# Altium schematic sheet AEBS component_FrontV1.2.SchDoc
size A4
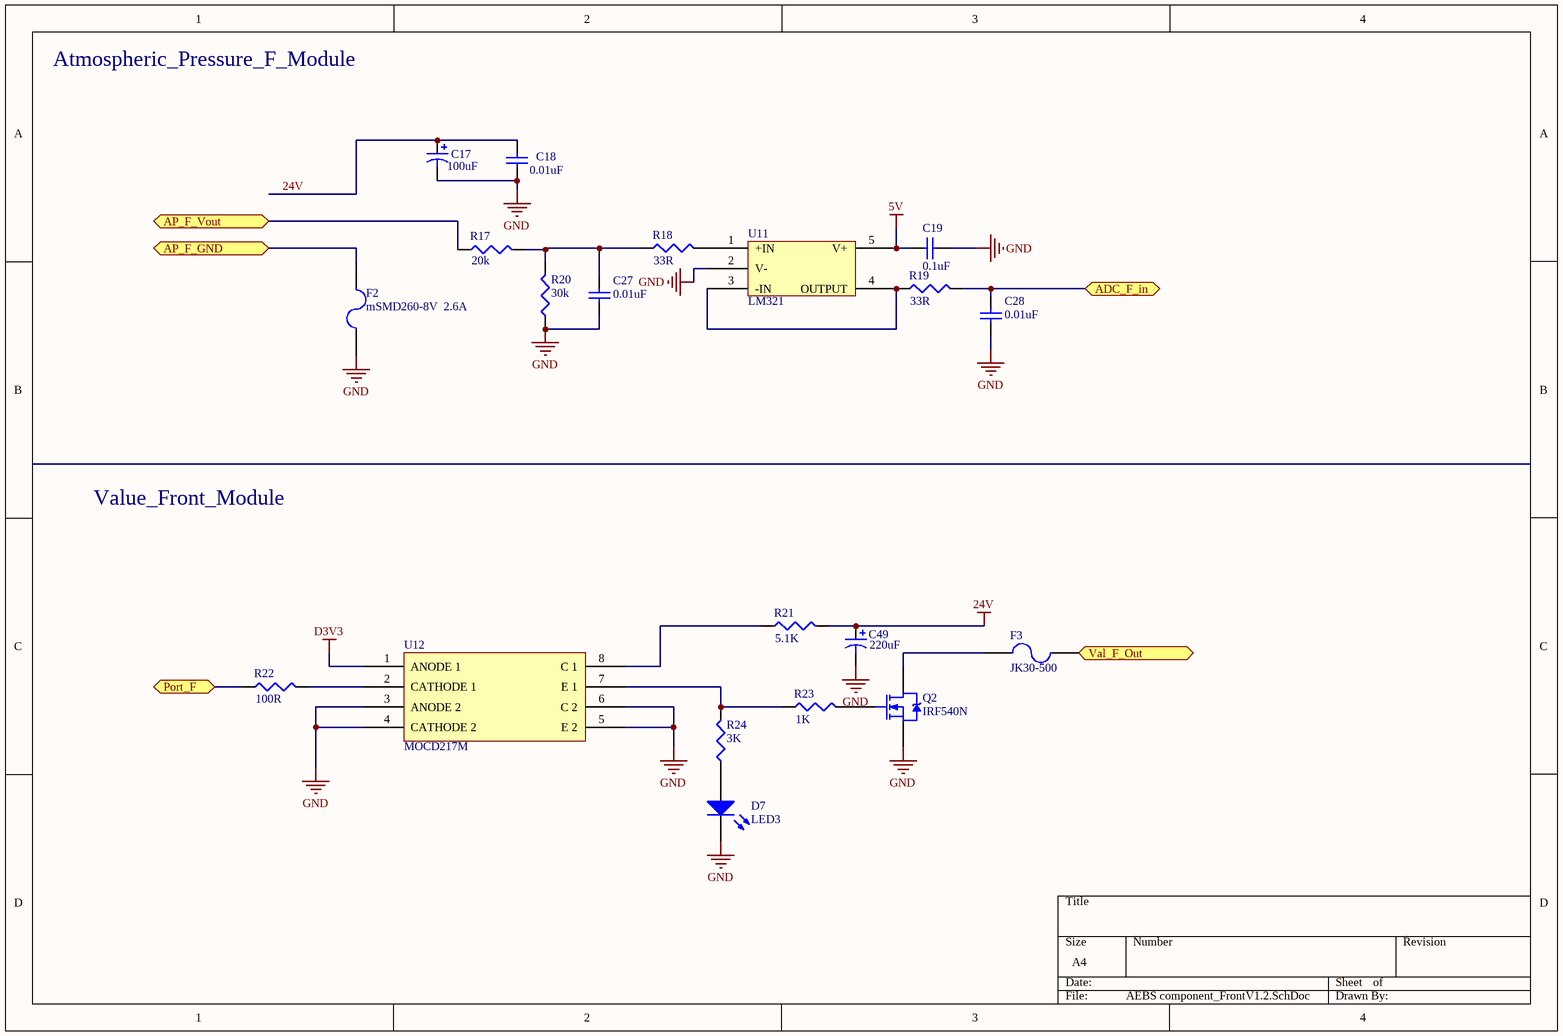
[diagram p0: AEBS component_FrontV1.2.SchDoc]

## Parts
C17  value 100uF  [C0805]  (hidden comment: Cap Pol3)
C18  value 0.01uF  [C1206]  (hidden comment: Cap Semi)
C19  value 0.1uF  [1608[0603]]  (hidden comment: Cap Semi)
C27  value 0.01uF  [1608[0603]]  (hidden comment: Cap Semi)
C28  value 0.01uF  [1608[0603]]  (hidden comment: Cap Semi)
C49  value 220uF  [Cap_pol_8*10.2]  (hidden comment: Cap Pol1)
D7  LED3  [1206]
F2  mSMD260-8V  2.6A  [1812]
F3  JK30-500  [JK30-500]
Q2  IRF540N  [TO-220AB]
R17  value 20k  [J1-0603]  (hidden comment: Res3)
R18  value 33R  [J1-0603]  (hidden comment: Res3)
R19  value 33R  [J1-0603]  (hidden comment: Res3)
R20  value 30k  [J1-0603]  (hidden comment: Res3)
R21  value 5.1K  [J1-0603]  (hidden comment: Res3)
R22  value 100R  [J1-0603]  (hidden comment: Res3)
R23  value 1K  [J1-0603]  (hidden comment: Res3)
R24  value 3K  [J1-0603]  (hidden comment: Res3)
U11  LM321  [LM321]
U12  MOCD217M  [MOCD217M]

## Ports
ADC_F_in (bidir), AP_F_GND (bidir), AP_F_Vout (bidir), Port_F (bidir), Val_F_Out (bidir)

## Nets
5V: C19.2 U11.5(V+)
24V: C17.1 C18.1 C49.1 R21.2
D3V3: U12.1(ANODE_1)
GND: C17.2 C18.2 C19.1 C27.1 C28.1 C49.2 D7.2(K) F2.2 Q2.3(S) R20.1 U11.2(V-) U12.3(ANODE_2) U12.4(CATHODE_2) U12.5(E_2) U12.6(C_2)
ADC_F_in: C28.2 R19.2 ; port ADC_F_in
AP_F_GND: F2.1 ; port AP_F_GND
AP_F_Vout: R17.1 ; port AP_F_Vout
Port_F: R22.1 ; port Port_F
Val_F_Out: F3.2 ; port Val_F_Out
NetC27_2: C27.2 R17.2 R18.1 R20.2
NetD7_1: D7.1(A) R24.1
NetF3_1: F3.1 Q2.2(D)
NetQ2_1: Q2.1(G) R23.2
NetR18_2: R18.2 U11.1(+IN)
NetR19_1: R19.1 U11.3(-IN) U11.4(OUTPUT)
NetR21_1: R21.1 U12.8(C_1)
NetR22_2: R22.2 U12.2(CATHODE_1)
NetR23_1: R23.1 R24.2 U12.7(E_1)

## Notes on the sheet
- Atmospheric_Pressure_F_Module
- Value_Front_Module

## Library data of the parts
C17 = Cap Pol3: Polarized Capacitor (Surface Mount); Published: 8-Jun-2000; LatestRevisionDate: 29-May-2009; LatestRevisionNote: IPC-7351 Footprint Added.; PackageReference: C0805; Publisher: Altium Limited; PackageDescription: Chip Capacitor
C18 C19 C27 C28 = Cap Semi: Capacitor (Semiconductor SIM Model); Published: 8-Jun-2000; LatestRevisionDate: 29-May-2009; LatestRevisionNote: IPC-7351 Footprint Added.; PackageReference: C1206; Publisher: Altium Limited; PackageDescription: Chip Capacitor
C49 = Cap Pol1: Polarized Capacitor (Radial); Published: 8-Jun-2000; LatestRevisionDate: 17-Jul-2002; LatestRevisionNote: Re-released for DXP Platform.; PackageReference: RB7.6-15; Publisher: Altium Limited; PackageDescription: Polarized Capacitor (Radial); 2 Leads
D7 = LED3: Typical BLUE SiC LED; Published: 8-Jun-2000; LatestRevisionDate: 17-Dec-2003; LatestRevisionNote: PCB Footprint replaced.; DatasheetVersion: 16-Apr-2002; PackageVersion: 16-Apr-2002; PackageReference: 3.5X2.8X1.9; Publisher: Altium Limited; PackageDescription: SM LED; 2 C-Bend Leads; Body 3.5 x 2.8 x 1.9 mm, inc leads (LxWxH typ)
F2 F3 = Fuse 2: Fuse; Published: 8-Jun-2000; LatestRevisionDate: 17-Jul-2002; LatestRevisionNote: Re-released for DXP Platform.; PackageReference: PIN-W2/E2.8; Publisher: Altium Limited; PackageDescription: Thru-Hole; 2 Leads
Q2 = NMOS-2: N-Channel Power MOSFET; Note: Pin 2 is electrically connected to pin 4.; Published: 8-Jun-2000; LatestRevisionDate: 17-Jul-2002; LatestRevisionNote: Re-released for DXP Platform.; DatasheetVersion: PD-9.814; PackageVersion: Feb-1997; PackageReference: TO-220AB; Publisher: Altium Limited; PackageDescription: TO, Thru-Hole, Vertical, Heatsink Mounted; 3 In-Line Leads; Pitch 2.54 mm; ComponentLink1Description: Manufacturer Link; ComponentLink1URL: http://www.irf.com/
R17-R24 = Res3: Resistor; Published: 8-Jun-2000; LatestRevisionDate: 29-May-2009; LatestRevisionNote: IPC-7351 Footprint Added.; PackageReference: J1-0603; Publisher: Altium Limited; PackageDescription: Chip Resistor